# Altium schematic sheet [08] - USB.SchDoc: USB
size A4; Organization: Bjørn T. Brodtkorb; Address1: Frode Rinnans veg 161; Address2: 7050 Trondheim; DocumentNumber: 9; Revision: 1.0; SheetNumber: 9; SheetTotal: 13
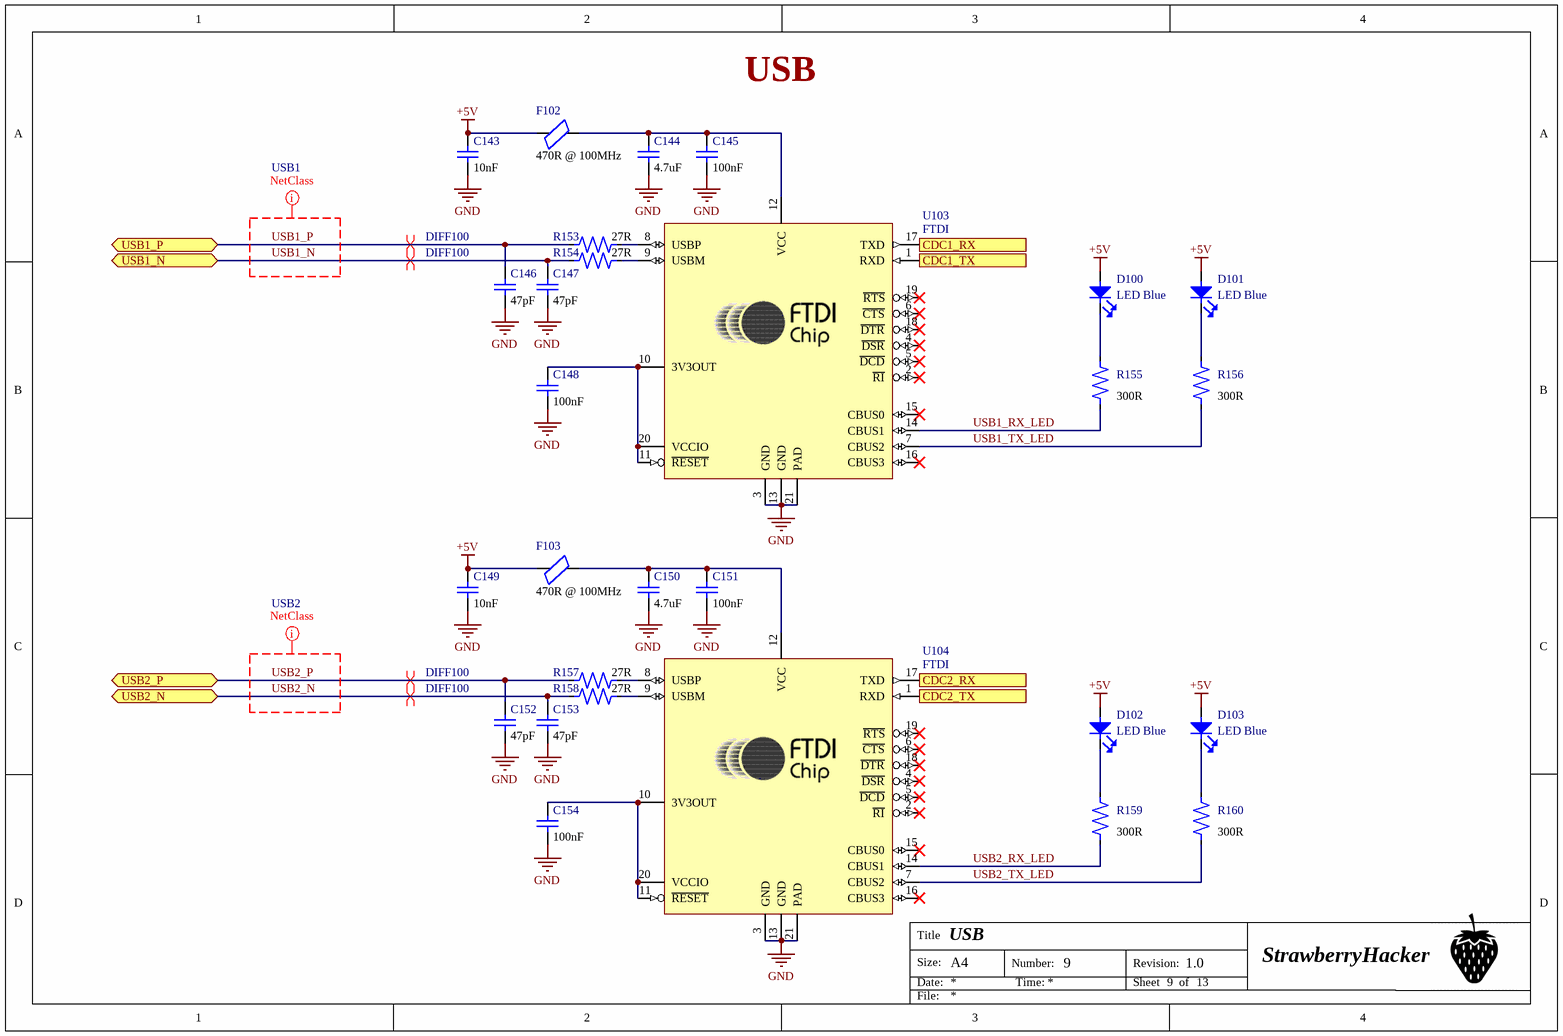
[diagram p0: [08] - USB.SchDoc]

## Parts
C143  value 10nF  [C0402]  (hidden comment: 04023C103KAT2A)
C144  value 4.7uF  [C0603]  (hidden comment: 02016D104KAT2A)
C145  value 100nF  [C0402]  (hidden comment: 04023C103KAT2A)
C146  value 47pF  [C0402]  (hidden comment: 04023C103KAT2A)
C147  value 47pF  [C0402]  (hidden comment: 04023C103KAT2A)
C148  value 100nF  [C0402]  (hidden comment: 04023C103KAT2A)
C149  value 10nF  [C0402]  (hidden comment: 04023C103KAT2A)
C150  value 4.7uF  [C0603]  (hidden comment: 02016D104KAT2A)
C151  value 100nF  [C0402]  (hidden comment: 04023C103KAT2A)
C152  value 47pF  [C0402]  (hidden comment: 04023C103KAT2A)
C153  value 47pF  [C0402]  (hidden comment: 04023C103KAT2A)
C154  value 100nF  [C0402]  (hidden comment: 04023C103KAT2A)
D100  LED Blue  [L0603 BLUE]
D101  LED Blue  [L0603 BLUE]
D102  LED Blue  [L0603 BLUE]
D103  LED Blue  [L0603 BLUE]
F102  value 470R @ 100MHz  [Ferrite bead 0402]  (hidden comment: BLM15AG102SN1D)
F103  value 470R @ 100MHz  [Ferrite bead 0402]  (hidden comment: BLM15AG102SN1D)
R153  value 27R  [R0402]  (hidden comment: CRCW04020000Z0ED)
R154  value 27R  [R0402]  (hidden comment: CRCW04020000Z0ED)
R155  value 300R  [R0402]  (hidden comment: CRCW04020000Z0ED)
R156  value 300R  [R0402]  (hidden comment: CRCW04020000Z0ED)
R157  value 27R  [R0402]  (hidden comment: CRCW04020000Z0ED)
R158  value 27R  [R0402]  (hidden comment: CRCW04020000Z0ED)
R159  value 300R  [R0402]  (hidden comment: CRCW04020000Z0ED)
R160  value 300R  [R0402]  (hidden comment: CRCW04020000Z0ED)
U103  FTDI  [FT231XQ-R]
U104  FTDI  [FT231XQ-R]

## Ports
CDC1_RX (out), CDC1_TX (in), CDC2_RX (out), CDC2_TX (in), USB1_N (bidir), USB1_P (bidir), USB2_N (bidir), USB2_P (bidir)

## Nets
+5V: C143.2 C149.2 D100.1 D101.1 D102.1 D103.1 F102.1 F103.1
GND: C143.1 C144.1 C145.1 C146.1 C147.1 C148.1 C149.1 C150.1 C151.1 C152.1 C153.1 C154.1 U103.3(GND) U103.13(GND) U103.21(PAD) U104.3(GND) U104.13(GND) U104.21(PAD)
CDC1_RX: U103.17(TXD) ; port CDC1_RX
CDC1_TX: U103.1(RXD) ; port CDC1_TX
CDC2_RX: U104.17(TXD) ; port CDC2_RX
CDC2_TX: U104.1(RXD) ; port CDC2_TX
USB1_N: C147.2 R154.1 ; port USB1_N
USB1_P: C146.2 R153.1 ; port USB1_P
USB1_RX_LED: R155.1 U103.14(CBUS1)
USB1_TX_LED: R156.1 U103.7(CBUS2)
USB2_N: C153.2 R158.1 ; port USB2_N
USB2_P: C152.2 R157.1 ; port USB2_P
USB2_RX_LED: R159.1 U104.14(CBUS1)
USB2_TX_LED: R160.1 U104.7(CBUS2)
NetC144_2: C144.2 C145.2 F102.2 U103.12(VCC)
NetC148_2: C148.2 U103.10(3V3OUT) U103.11(~{RESET}) U103.20(VCCIO)
NetC150_2: C150.2 C151.2 F103.2 U104.12(VCC)
NetC154_2: C154.2 U104.10(3V3OUT) U104.11(~{RESET}) U104.20(VCCIO)
NetD100_2: D100.2 R155.2
NetD101_2: D101.2 R156.2
NetD102_2: D102.2 R159.2
NetD103_2: D103.2 R160.2
NetR153_2: R153.2 U103.8(USBP)
NetR154_2: R154.2 U103.9(USBM)
NetR157_2: R157.2 U104.8(USBP)
NetR158_2: R158.2 U104.9(USBM)

Not connected (* = marked no-connect by the designer): U103 2(~{RI})* 4(~{DSR})* 5(~{DCD})* 6(~{CTS})* 15(CBUS0)* 16(CBUS3)* 18(~{DTR})* 19(~{RTS})*; U104 2(~{RI})* 4(~{DSR})* 5(~{DCD})* 6(~{CTS})* 15(CBUS0)* 16(CBUS3)* 18(~{DTR})* 19(~{RTS})*

## Layout directives
differential pair; differential pair class DIFF100: USB1_N, USB1_P, USB2_N, USB2_P
net class USB1: USB1_N, USB1_P
net class USB2: USB2_N, USB2_P

## Notes on the sheet
- USB
- Title
- Size:
- Date:
- A4
- Number:
- Time:
- Revision:
- Sheet
- of
- StrawberryHacker
- File:

## Library data of the parts
C143 C145-C149 C151-C154 = 04023C103KAT2A: C0402
C144 C150 = 02016D104KAT2A: C0603
D100-D103 = HSMG-C199: LED 0603 Blue
F102 F103 = BLM15AG102SN1D: Ferrite bead 0402
R153-R160 = CRCW04020000Z0ED: R0402
U103 U104 = FT231XQ-R: USB to RS-232 converter; Supplier Part Number 1: 2081330; Supplier 1: Farnell